# EAGLE schematic ethernet_7 (EAGLE 6.2)
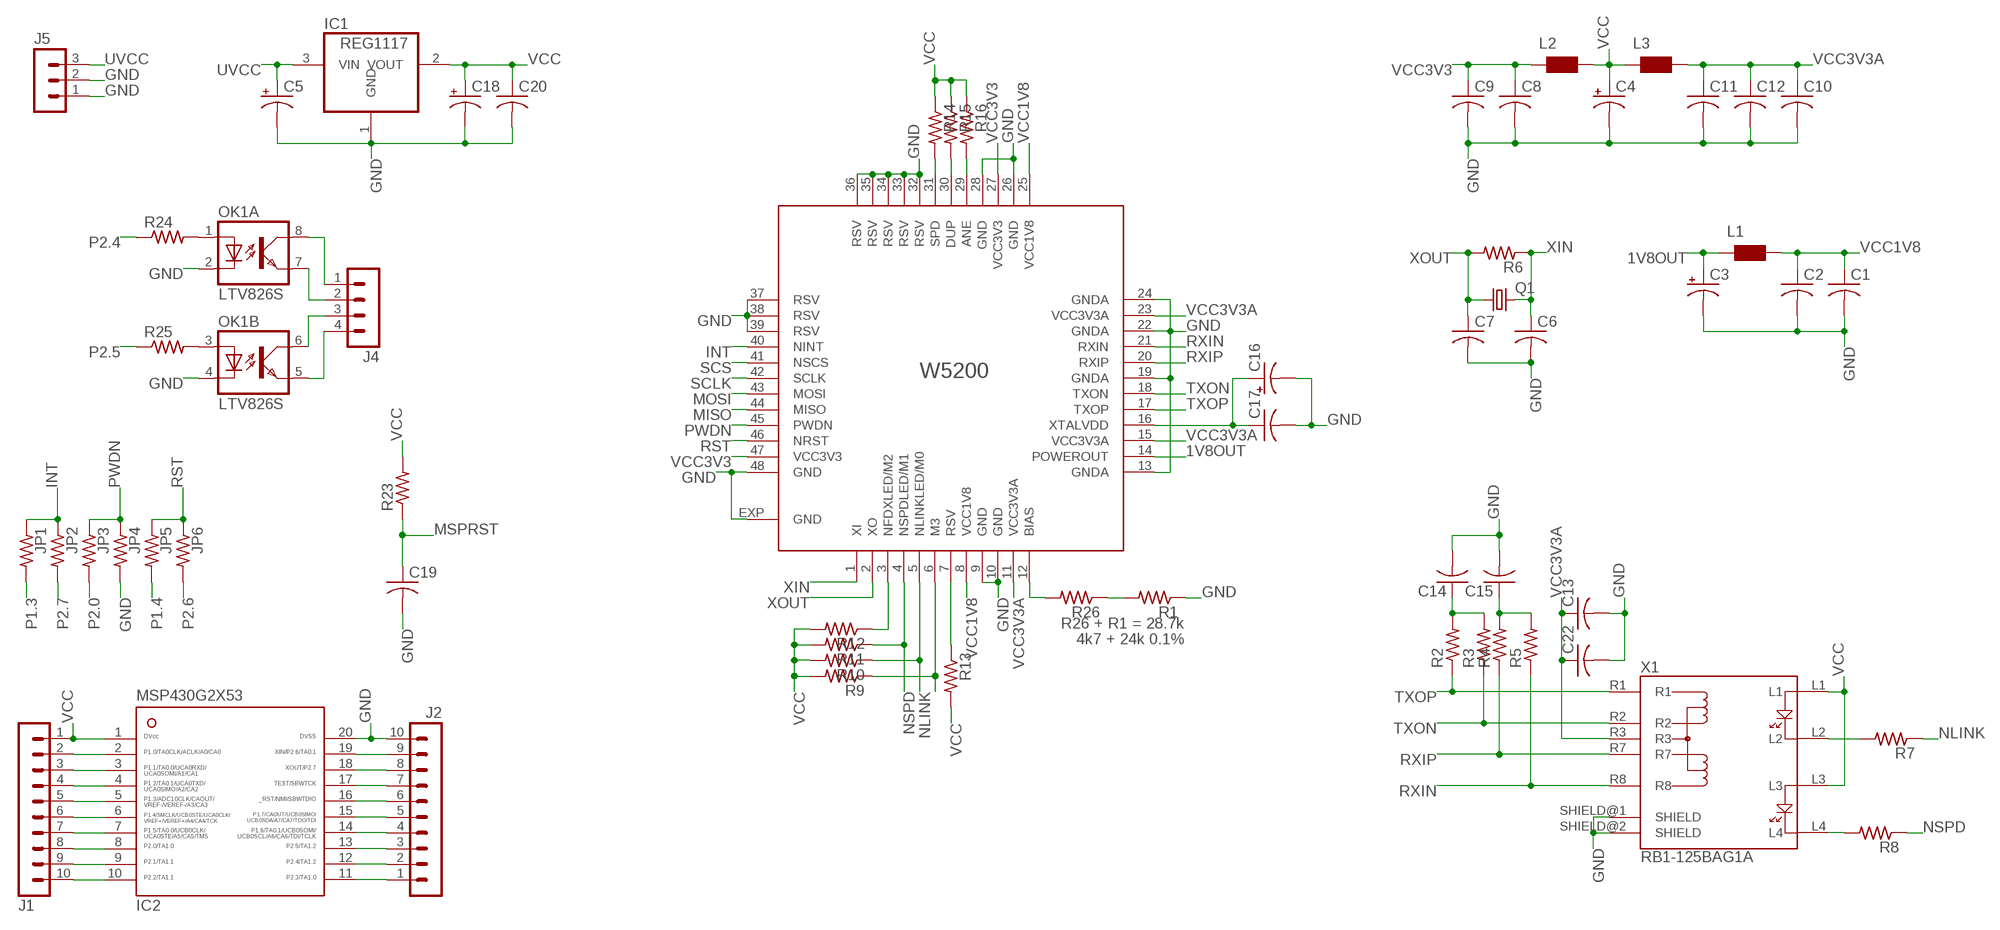
[diagram p0: schematic, sheet 1]

## Parts
C1  C-USC0603  [C0603]
C2  C-USC0603  [C0603]
C3  CPOL-USA/3216-18R  [A/3216-18R]
C4  CPOL-USA/3216-18R  [A/3216-18R]
C5  CPOL-USB/3528-21R  [B/3528-21R]
C6  C-USC0603  [C0603]
C7  C-USC0603  [C0603]
C8  C-USC0603  [C0603]
C9  C-USC0603  [C0603]
C10  C-USC0603  [C0603]
C11  C-USC0603  [C0603]
C12  C-USC0603  [C0603]
C13  C-USC0603  [C0603]
C14  C-USC0603  [C0603]
C15  C-USC0603  [C0603]
C16  CPOL-USA/3216-18R  [A/3216-18R]
C17  C-USC0603  [C0603]
C18  CPOL-USB/3528-21R  [B/3528-21R]
C19  C-USC0603  [C0603]
C20  C-USC0603  [C0603]
C22  C-USC0603  [C0603]
IC1  REG1117  [SOT223]
IC2  MSP430G2X53-20N20  [N20]
J1  MA10-1NOTXT  [MA10-1-NOTXT]
J2  MA10-1NOTXT  [MA10-1-NOTXT]
J4  MA04-1-ALLV  [MA04-1]
J5  MA03-1  [MA03-1]
JP1  R-US_R0603  [R0603]
JP2  R-US_R0603  [R0603]
JP3  R-US_R0603  [R0603]
JP4  R-US_R0603  [R0603]
JP5  R-US_R0603  [R0603]
JP6  R-US_R0603  [R0603]
L1  WE-CBF_0603  [0603]
L2  WE-CBF_0603  [0603]
L3  WE-CBF_0603  [0603]
OK1  LTV826S  [DIL8-SMD]
Q1  CRYSTALSM49  [SM49]
R1  R-US_R0603  [R0603]
R2  R-US_R0603  [R0603]
R3  R-US_R0603  [R0603]
R4  R-US_R0603  [R0603]
R5  R-US_R0603  [R0603]
R6  R-US_R0603  [R0603]
R7  R-US_R0603  [R0603]
R8  R-US_R0603  [R0603]
R9  R-US_R0603  [R0603]
R10  R-US_R0603  [R0603]
R11  R-US_R0603  [R0603]
R12  R-US_R0603  [R0603]
R13  R-US_R0603  [R0603]
R14  R-US_R0603  [R0603]
R15  R-US_R0603  [R0603]
R16  R-US_R0603  [R0603]
R23  R-US_R0603  [R0603]
R24  R-US_R0603  [R0603]
R25  R-US_R0603  [R0603]
R26  R-US_R0603  [R0603]
W5200  W52003  [QFN48-3]
X1  RB1-125BAG1A  [RB1-125BAG1A]

## Nets
1V8OUT: C3.+ L1.1 W5200.14(POWEROUT)
BIAS: R26.2 W5200.12(BIAS)
GND: C1.2 C2.2 C3.- C4.- C5.- C6.2 C7.2 C8.2 C9.2 C10.2 C11.2 C12.2 C13.2 C14.2 C15.2 C16.- C17.2 C18.- C19.2 C20.2 C22.2 IC1.1(GND) IC2.20 J2.10 J5.1 J5.2 JP4.2 OK1.2(A:C) OK1.4(B:C) R1.1 W5200.9(GND) W5200.10(GND) W5200.13(GNDA) W5200.19(GNDA) W5200.22(GNDA) W5200.24(GNDA) W5200.26(GND) W5200.28(GND) W5200.32(RSV) W5200.33(RSV) W5200.34(RSV) W5200.35(RSV) W5200.36(RSV) W5200.37(RSV) W5200.38(RSV) W5200.39(RSV) W5200.48(GND) W5200.EXP(GND) X1.SHIELD@1(SHIELD) X1.SHIELD@2(SHIELD)
INT: JP1.1 JP2.1 W5200.40(NINT)
M2: R12.1 W5200.3(NFDXLED/M2)
M3: R9.1 W5200.6(M3)
MISO: IC2.14 J2.4 W5200.44(MISO)
MOSI: IC2.15 J2.5 W5200.43(MOSI)
MSPRST: C19.1 IC2.16 J2.6 R23.1
N$1: J4.2 OK1.7(A:EMIT)
N$2: J4.1 OK1.8(A:COL)
N$3: IC2.3 J1.3
N$4: IC2.4 J1.4
N$5: J4.3 OK1.6(B:COL)
N$6: J4.4 OK1.5(B:EMIT)
N$7: OK1.1(A:A) R24.2
N$8: OK1.3(B:A) R25.2
N$9: R1.2 R26.1
N$11: IC2.17 J2.7
N$16: IC2.9 J1.9
N$17: IC2.10 J1.10
N$20: IC2.11 J2.1
N$21: R7.2 X1.L2
N$22: R8.2 X1.L4
N$30: R14.2 W5200.31(SPD)
N$31: R15.2 W5200.30(DUP)
N$32: C14.1 R2.2 R3.2
N$33: C15.1 R4.2 R5.2
N$34: R16.2 W5200.29(ANE)
NLINK: R7.1 R10.1 W5200.5(NLINKLED/M0)
NSPD: R8.1 R11.1 W5200.4(NSPDLED/M1)
P1.3: IC2.5 J1.5 JP1.2
P1.4: IC2.6 J1.6 JP5.2
P2.0: IC2.8 J1.8 JP3.2
P2.4: IC2.12 J2.2 R24.1
P2.5: IC2.13 J2.3 R25.1
P2.6: IC2.19 J2.9 JP6.2
P2.7: IC2.18 J2.8 JP2.2
PWDN: JP3.1 JP4.1 W5200.45(PWDN)
RST: JP5.1 JP6.1 W5200.46(NRST)
RSV: R13.1 W5200.7(RSV)
RXIN: R5.1 W5200.21(RXIN) X1.R8
RXIP: R4.1 W5200.20(RXIP) X1.R7
SCLK: IC2.7 J1.7 W5200.42(SCLK)
SCS: IC2.2 J1.2 W5200.41(NSCS)
TXON: R3.1 W5200.18(TXON) X1.R2
TXOP: R2.1 W5200.17(TXOP) X1.R1
UVCC: C5.+ IC1.3(VIN) J5.3
VCC: C4.+ C18.+ C20.1 IC1.2(VOUT) IC2.1 J1.1 L2.2 L3.1 R9.2 R10.2 R11.2 R12.2 R13.2 R14.1 R15.1 R16.1 R23.2 X1.L1 X1.L3
VCC1V8: C1.1 C2.1 L1.2 W5200.8(VCC1V8) W5200.25(VCC1V8)
VCC3V3: C8.1 C9.1 L2.1 W5200.27(VCC3V3) W5200.47(VCC3V3)
VCC3V3A: C10.1 C11.1 C12.1 C13.1 C22.1 L3.2 W5200.11(VCC3V3A) W5200.15(VCC3V3A) W5200.23(VCC3V3A) X1.R3
XIN: C6.1 Q1.2 R6.1 W5200.1(XI)
XOUT: C7.1 Q1.1 R6.2 W5200.2(XO)
XTALVDD: C16.+ C17.1 W5200.16(XTALVDD)

## Notes on the sheet
- R26 + R1 = 28.7k
- 4k7 + 24k 0.1%

## Library data of the parts
C1 C2 C6-C15 C17 C19 C20 C22 = rcl:C-US: CAPACITOR, American symbol
C3-C5 C16 C18 = rcl:CPOL-US: POLARIZED CAPACITOR, American symbol
IC1 = burr-brown:REG1117: 800mA and 1A Low Dropout (LDO) Positive Regulator 1.8V, 2.5V, 2.85V, 3.3V, 5V, and Adj
IC2 = ti_msp430g:MSP430G2X53-20
J1 J2 = con-lstb:MA10-1: PIN HEADER
J4 = con-lstb:MA04-1-ALL: PIN HEADER
J5 = con-lstb:MA03-1: PIN HEADER
JP1-JP6 R1-R16 R23-R26 = rcl:R-US_: RESISTOR, American symbol
L1-L3 = wuerth-elektronik:WE-CBF: SMD EMI Suppression Ferrite Beads - excellent anti-EMI properties - low DCR - impedances till 3000 ohms - rated current up to 6 A
OK1 = optocoupler:LTV826: OPTO COUPLER Source: LITEON, LTV816.pdf
Q1 = crystal:CRYSTAL: CRYSTAL
W5200 = Rob's Library:W5200
X1 = Rob's Library:RB1-125BAG1A: MagJack RB1-125BAG1A